# Altium project PowerPCB.PrjPcb
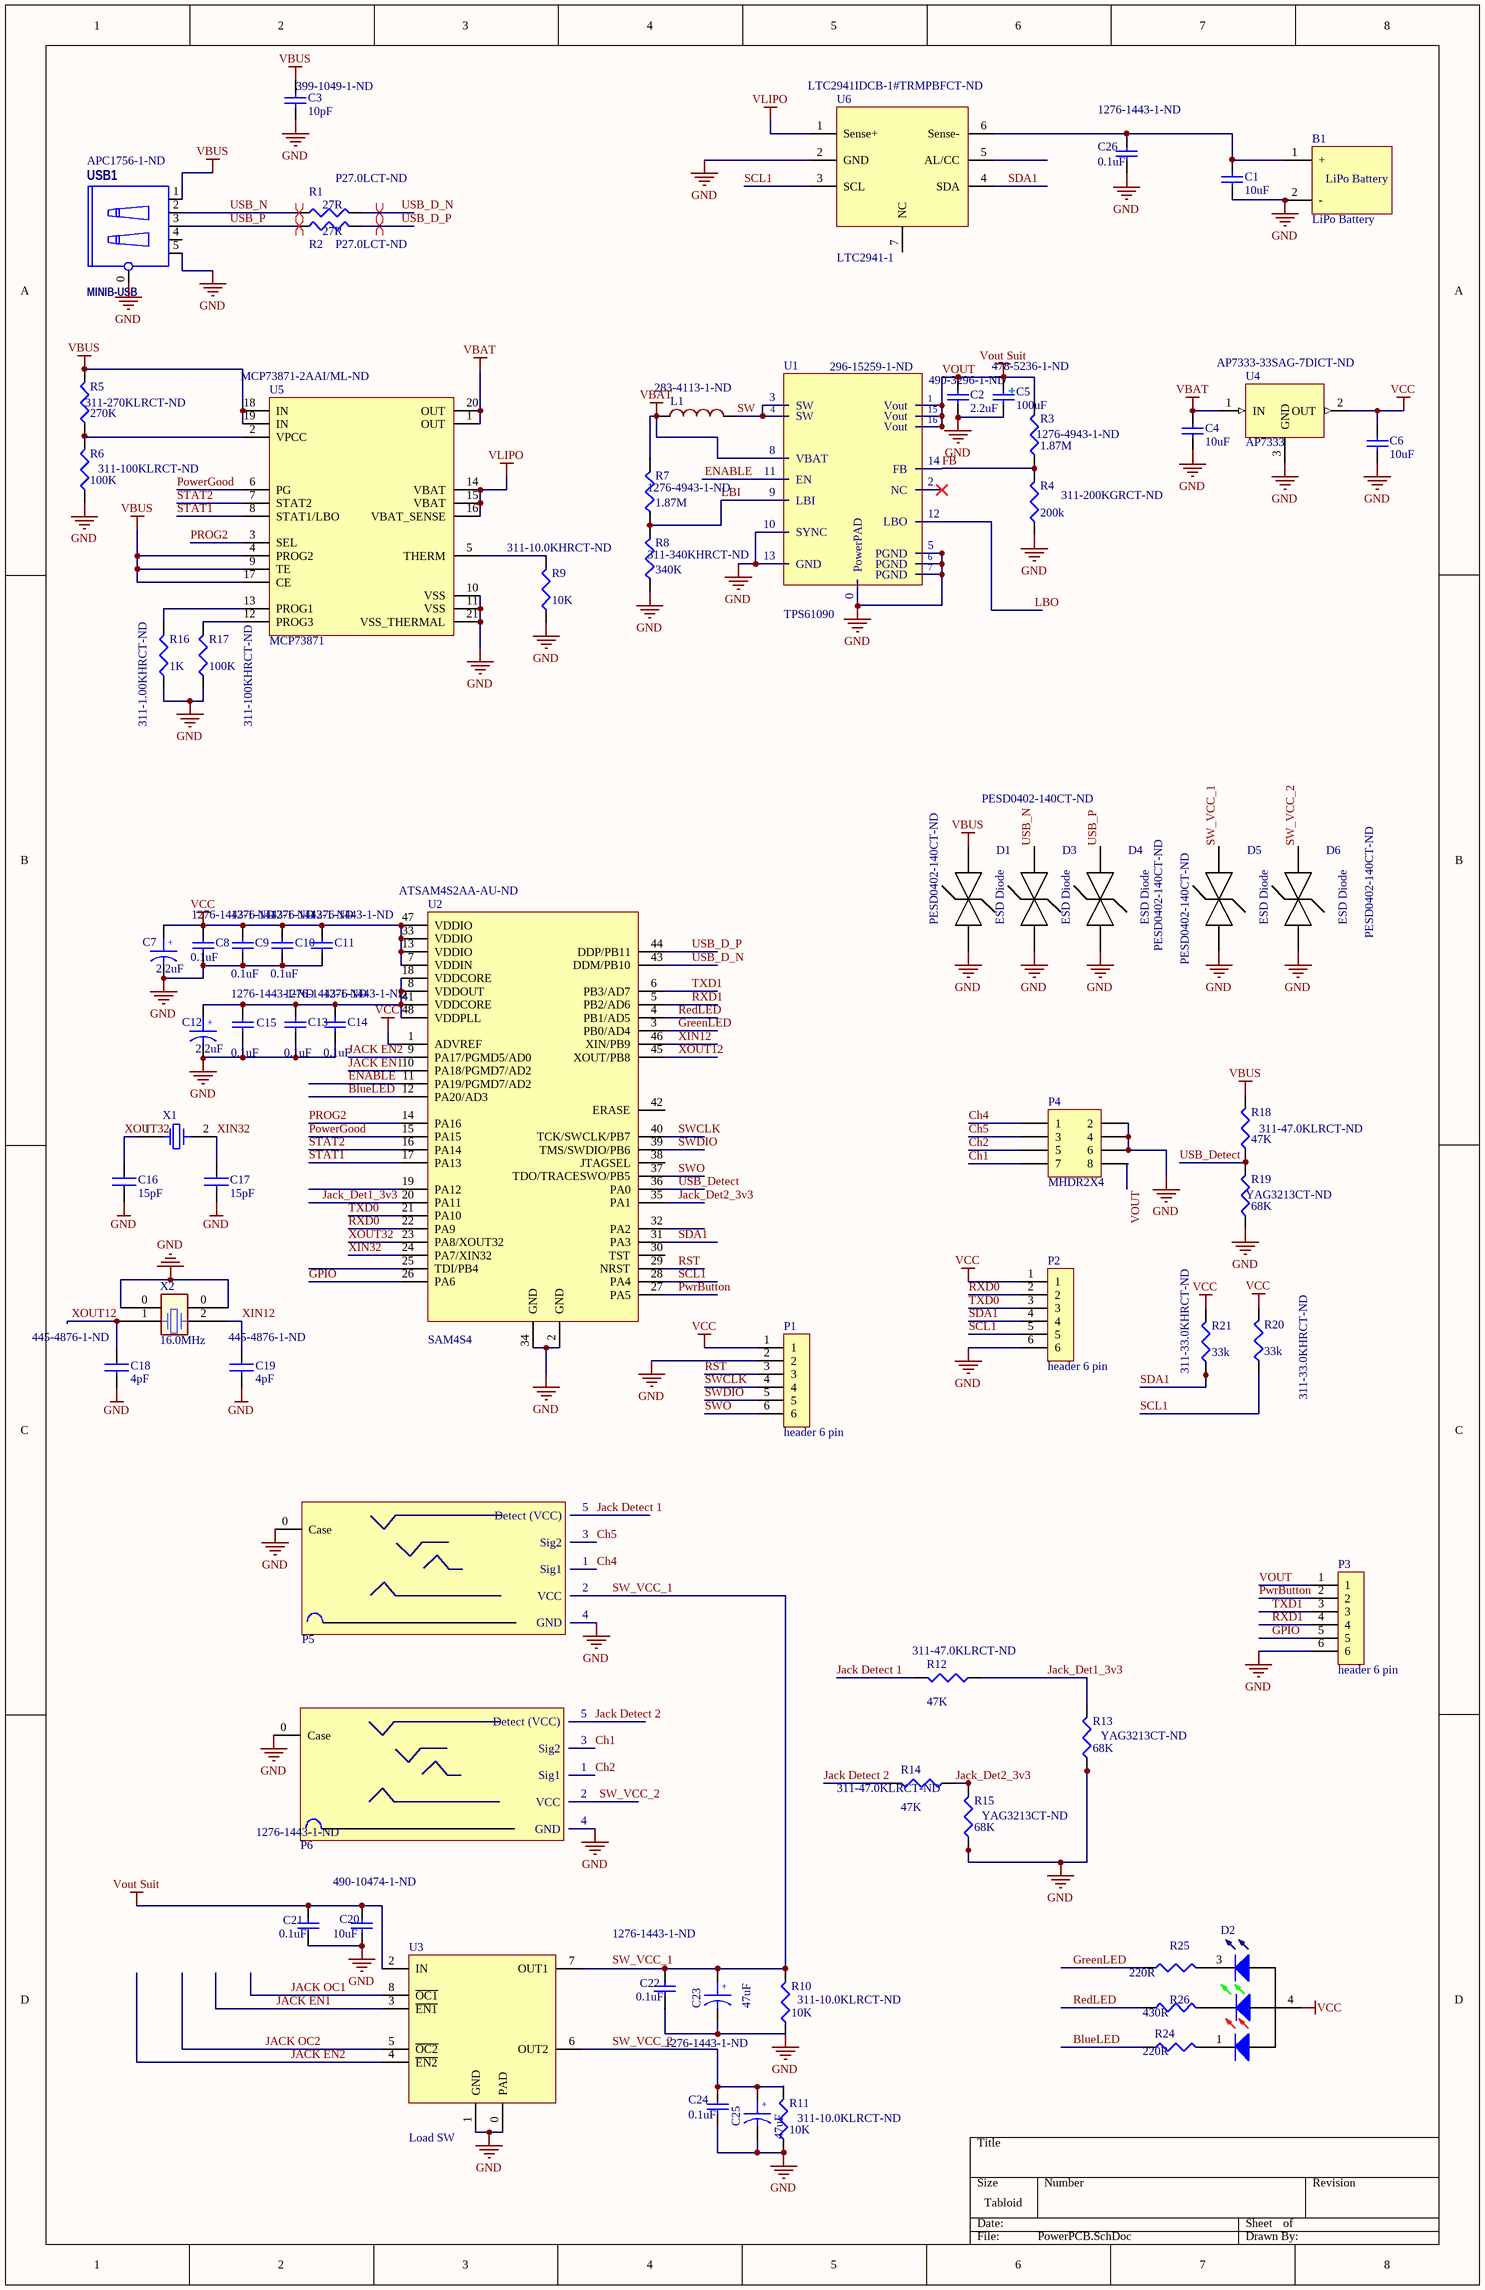
[diagram p0: PowerPCB.SchDoc]
1 sheet, 73 parts. Net scope: global (net labels, ports and power ports of the same name join across sheets).
Board file: PowerPCB.PcbDoc

## Sheet PowerPCB.SchDoc
size Tabloid portrait; PageSetup: Record=PageOptions|CenterHorizontal=True|CenterVertical=True|PrintScale=0.62|XCorrection=1.00|YCorrection=1.00|PrintKind=1|BorderSize=5000000|LeftOffset=0|BottomOffset=0|Orientation=1|PaperLength=1000|PaperWidth=1000|Scale=100|PaperSource=257|PrintQuality=600|MediaType=1|DitherType=10|PrintScaleMode=1|PaperKind=Letter|PaperIndex=1

### Parts
B1  LiPo Battery  [LiPo Battery]
C1  value 10uF  [0603_small]
C2  value 2.2uF  Supplier Part Number: 490-3296-1-ND  [0603_small]
C3  value 10pF  Supplier Part Number: 399-1049-1-ND  [0603_small]
C4  value 10uF  [0603_small]
C5  value 100uF  Supplier Part Number: 478-5236-1-ND  [C 6032-28R]  (hidden comment: Cap_Tant)
C6  value 10uF  [0603_small]
C7  value 2.2uF  [SMD0805]
C8  value 0.1uF  Supplier Part Number: 1276-1443-1-ND  [0402]
C9  value 0.1uF  Supplier Part Number: 1276-1443-1-ND  [0402]
C10  value 0.1uF  Supplier Part Number: 1276-1443-1-ND  [0402]
C11  Supplier Part Number: 1276-1443-1-ND  [0402]
C12  value 2.2uF  [SMD0805]
C13  value 0.1uF  Supplier Part Number: 1276-1443-1-ND  [0402]
C14  value 0.1uF  Supplier Part Number: 1276-1443-1-ND  [0402]
C15  value 0.1uF  Supplier Part Number: 1276-1443-1-ND  [0402]
C16  value 15pF  [CAP 0402]
C17  value 15pF  [CAP 0402]
C18  value 4pF  Supplier Part Number: 445-4876-1-ND  [0402]
C19  value 4pF  Supplier Part Number: 445-4876-1-ND  [0402]
C20  value 10uF  Supplier Part Number: 490-10474-1-ND  [0603_small]
C21  value 0.1uF  Supplier Part Number: 1276-1443-1-ND  [0402]
C22  value 0.1uF  Supplier Part Number: 1276-1443-1-ND  [0402]
C23  value 47uF  [1206]  (hidden comment: CAP-POL)
C24  value 0.1uF  Supplier Part Number: 1276-1443-1-ND  [0402]
C25  value 47uF  [1206]  (hidden comment: CAP-POL)
C26  value 0.1uF  Supplier Part Number: 1276-1443-1-ND  [0402]
D1  ESD Diode  Supplier Part Number: PESD0402-140CT-ND  [0402]
D2  LED2_RGB  [LED RGB]  (value not drawn)
D3  ESD Diode  Supplier Part Number: PESD0402-140CT-ND  [0402]
D4  ESD Diode  Supplier Part Number: PESD0402-140CT-ND  [0402]
D5  ESD Diode  Supplier Part Number 1: PESD0402-140CT-ND  [0402]
D6  ESD Diode  Supplier Part Number: PESD0402-140CT-ND  [0402]
L1  Supplier Part Number: 283-4113-1-ND  [Inductor - Small]  (hidden comment: 6.8uH)
P1  header 6 pin  [Header 6 1.27mm]
P2  header 6 pin  [Header 6 1.27mm]
P3  header 6 pin  [Header 6 1.27mm]
P4  MHDR2X4  [MHDR2X4]
P5  IP67_Jack  [AudioJack IPX7]  (value not drawn)
P6  IP67_Jack  [AudioJack IPX7]  (value not drawn)
R1  value 27R  Supplier Part Number: P27.0LCT-ND  [0402]
R2  value 27R  Supplier Part Number: P27.0LCT-ND  [0402]
R3  value 1.87M  Supplier Part Number: 1276-4943-1-ND  [0603_small]
R4  value 200k  Supplier Part Number: 311-200KGRCT-ND  [0603_small]
R5  value 270K  Supplier Part Number: 311-270KLRCT-ND  [0402]
R6  value 100K  Supplier Part Number: 311-100KLRCT-ND  [0402]
R7  value 1.87M  Supplier Part Number: 1276-4943-1-ND  [0603_small]
R8  value 340K  Supplier Part Number: 311-340KHRCT-ND  [0603_small]
R9  value 10K  Supplier Part Number: 311-10.0KHRCT-ND  [0603_small]
R10  value 10K  Supplier Part Number: 311-10.0KLRCT-ND  [0402]
R11  value 10K  Supplier Part Number: 311-10.0KLRCT-ND  [0402]
R12  value 47K  Supplier Part Number: 311-47.0KLRCT-ND  [0402]
R13  value 68K  Supplier Part Number: YAG3213CT-ND  [0402]
R14  value 47K  Supplier Part Number: 311-47.0KLRCT-ND  [0402]
R15  value 68K  Supplier Part Number: YAG3213CT-ND  [0402]
R16  value 1K  Supplier Part Number: 311-1.00KHRCT-ND  [0603_small]
R17  value 100K  Supplier Part Number: 311-100KHRCT-ND  [0603_small]
R18  value 47K  Supplier Part Number: 311-47.0KLRCT-ND  [0402]
R19  value 68K  Supplier Part Number: YAG3213CT-ND  [0402]
R20  value 33k  Supplier Part Number: 311-33.0KHRCT-ND  [0603_small]
R21  value 33k  Supplier Part Number: 311-33.0KHRCT-ND  [0603_small]
R24  value 220R  [0603_small]
R25  value 220R  [0603_small]
R26  value 430R  [0603_small]
U1  TPS61090  Supplier Part Number: 296-15259-1-ND  [QFN 16 PQFN VQFN PVQFN 16 RSA]
U2  SAM4S4  Supplier Part Number 1: ATSAM4S2AA-AU-ND  [QFP48]
U3  Load SW  [SON8_0.65MM]
U4  AP7333  Supplier Part Number 1: AP7333-33SAG-7DICT-ND  [SOT23-3]
U5  MCP73871  Supplier Part Number 1: MCP73871-2AAI/ML-ND  [QFN20]
U6  LTC2941-1  Supplier Part Number 1: LTC2941IDCB-1#TRMPBFCT-ND  [QFN6]
USB1  MINIB-USB  Supplier Part Number: APC1756-1-ND  [Micro USB IP67]
X1  Xtal 32  [Xtal smd 32khz - larger]  (value not drawn)
X2  value 16.0MHz  [Xtal smd 3.2X2.5]  (hidden comment: Xtal 16)

### Nets
GND: B1.2(-) C1.1 C2.1 C3.1 C4.1 C5.- C6.1 C7.2 C8.1 C9.1 C10.1 C11.1 C12.2 C13.1 C14.1 C15.1 C16.2 C17.2 C18.2 C19.2 C20.2 C21.2 C22.2 C23.2 C24.2 C25.2 C26.2 D1.2 D3.2 D4.2 D5.2 D6.2 P1.2 P2.6 P3.6 P4.2 P4.4 P4.6 P5.0(Case) P5.4(GND) P6.0(Case) P6.4(GND) R4.1 R6.1 R8.1 R9.1 R11.1 R13.1 R15.1 R16.1 R17.1 R19.1 U1.0(PowerPAD) U1.5(PGND) U1.6(PGND) U1.7(PGND) U1.10(SYNC) U1.13(GND) U2.2(GND) U2.34(GND) U3.0(PAD) U3.1(GND) U4.3(GND) U5.10(VSS) U5.11(VSS) U5.21(VSS_THERMAL) U6.2(GND) USB1.0(GND) USB1.5 X2.0
VBAT: C4.2 L1.1 R7.2 U1.8(VBAT) U4.1(IN) U5.1(OUT) U5.20(OUT)
VBUS: C3.2 D1.1 R5.2 R18.2 U5.4(PROG2) U5.9(TE) U5.17(CE) U5.18(IN) U5.19(IN) USB1.1
VCC: C6.2 C7.1 C8.2 C9.2 C10.2 C11.2 D2.4 P1.1 P2.1 R20.2 R21.2 U2.1(ADVREF) U2.7(VDDIN) U2.13(VDDIO) U2.33(VDDIO) U2.47(VDDIO) U4.2(OUT)
VLIPO: U5.14(VBAT) U5.15(VBAT) U5.16(VBAT_SENSE) U6.1(Sense+)
VOUT: C2.2 C5.+ C20.1 C21.1 P3.1 P4.8 R3.2 U1.1(Vout) U1.15(Vout) U1.16(Vout) U3.2(IN)  [also labelled Vout Suit]
BlueLED: R24.1 U2.12(PA20/AD3)
Ch1: P4.7 P6.3(Sig2)
Ch2: P4.5 P6.1(Sig1)
Ch4: P4.1 P5.1(Sig1)
Ch5: P4.3 P5.3(Sig2)
ENABLE: U1.11(EN) U2.11(PA19/PGMD7/AD2)
FB: R3.1 R4.2 U1.14(FB)
GPIO: P3.5 U2.26(PA6)
GreenLED: R25.1 U2.3(PB0/AD4)
Jack Detect 1: P5.5(Detect_(VCC)) R12.2
Jack Detect 2: P6.5(Detect_(VCC)) R14.2
JACK EN1: U2.10(PA18/PGMD7/AD2) U3.3(~{EN1})
JACK EN2: U2.9(PA17/PGMD5/AD0) U3.4(~{EN2})
JACK OC1: U3.8(~{OC1})
JACK OC2: U3.5(~{OC2})
Jack_Det1_3v3: R12.1 R13.2 U2.20(PA11)
Jack_Det2_3v3: R14.1 R15.2 U2.35(PA1)
LBI: R7.1 R8.2 U1.9(LBI)
LBO: U1.12(LBO)
PowerGood: U2.15(PA15) U5.6(PG)
PROG2: U2.14(PA16) U5.3(SEL)
PwrButton: P3.2 U2.27(PA5)
RedLED: R26.1 U2.4(PB1/AD5)
RST: P1.3 U2.29(NRST)
RXD0: P2.2 U2.22(PA9)
RXD1: P3.4 U2.5(PB2/AD6)
SCL1: P2.5 R20.1 U2.28(PA4) U6.3(SCL)
SDA1: P2.4 R21.1 U2.31(PA3) U6.4(SDA)
STAT1: U2.17(PA13) U5.8(STAT1/LBO)
STAT2: U2.16(PA14) U5.7(STAT2)
SW: L1.2 U1.3(SW) U1.4(SW)
SW_VCC_1: C22.1 C23.1 D5.1 P5.2(VCC) R10.2 U3.7(OUT1)
SW_VCC_2: C24.1 C25.1 D6.1 P6.2(VCC) R11.2 U3.6(OUT2)
SWCLK: P1.4 U2.40(TCK/SWCLK/PB7)
SWDIO: P1.5 U2.39(TMS/SWDIO/PB6)
SWO: P1.6 U2.37(TDO/TRACESWO/PB5)
TXD0: P2.3 U2.21(PA10)
TXD1: P3.3 U2.6(PB3/AD7)
USB_D_N: R1.2 U2.43(DDM/PB10)
USB_D_P: R2.2 U2.44(DDP/PB11)
USB_Detect: R18.1 R19.2 U2.36(PA0)
USB_N: D3.1 R1.1 USB1.2
USB_P: D4.1 R2.1 USB1.3
XIN12: C19.1 U2.46(XIN/PB9) X2.2
XIN32: C17.1 U2.24(PA7/XIN32) X1.2
XOUT12: C18.1 U2.45(XOUT/PB8) X2.1
XOUT32: C16.1 U2.23(PA8/XOUT32) X1.1
NetB1_1: B1.1(+) C1.2 C26.1 U6.6(Sense-)
NetC12_1: C12.1 C13.2 C14.2 C15.2 U2.8(VDDOUT) U2.18(VDDCORE) U2.41(VDDCORE) U2.48(VDDPLL)
NetD2_1: D2.1 R24.2
NetD2_2: D2.2 R26.2
NetD2_3: D2.3 R25.2
NetR5_1: R5.1 R6.2 U5.2(VPCC)
NetR9_2: R9.2 U5.5(THERM)
NetR16_2: R16.2 U5.13(PROG1)
NetR17_2: R17.2 U5.12(PROG3)

Not connected (* = marked no-connect by the designer): R10 1; U1 2(NC)*; U2 19(PA12) 25(TDI/PB4) 30(TST) 32(PA2) 38(JTAGSEL) 42(ERASE); U6 5(AL/CC) 7(NC); USB1 4

### Layout directives
differential pair: USB_D_N, USB_D_P, USB_N, USB_P

### Notes on the sheet
- Labels drawn without touching a wire or pin: SW_VCC_1
- (in symbol A01-0492) +

### Library data of the parts
C1 C4 C6 = Cap: Manufacturer Part Number: GRM188R61C106MA73D; Manufacturer: Murata Electronics North America; Capacitance: 10µF; Temperature Coefficient: X5R; Voltage - Rated: 16V; Tolerance: ±20%; Pricing: 1=0.25, 10=0.234, 25=0.1996, 50=0.1698, 100=0.1632, 250=0.14652, 500=0.13986, 1000=0.11655 (CAD); ComponentLink1URL: http://www.murata.com/~/media/webrenewal/support/library/catalog/products/capacitor/mlcc/c02e.ashx; ComponentLink1Description: http://www.murata.com/~/media/webrenewal/support/library/catalog/products/capacitor/mlcc/c02e.ashx; Lead Spacing: -; Applications: General Purpose; Height - Seated (Max): -; Package / Case: 0603 (1608 Metric); Mounting Type: Surface Mount, MLCC; Lead Style: -; Packaging: Cut Tape (CT); Operating Temperature: -55°C ~ 85°C; Category: Capacitors; Size / Dimension: 0.063" L x 0.031" W (1.60mm x 0.80mm); Ratings: -; Supplier: Digi-Key; Thickness (Max): 0.031" (0.80mm); RoHS: RoHS Compliant; Features: -
C2 = Cap: Manufacturer: Murata Electronics North America; Manufacturer Part Number: GRM188R61C225KE15D; Temperature Coefficient: X5R; Capacitance: 2.2µF; Tolerance: ±10%; Voltage - Rated: 16V; Size / Dimension: 0.063" L x 0.031" W (1.60mm x 0.80mm); Category: Capacitors; Applications: General Purpose; Packaging: Cut Tape (CT); Operating Temperature: -55°C ~ 85°C; Height - Seated (Max): -; Lead Style: -; Thickness (Max): 0.035" (0.90mm); RoHS: RoHS Compliant; Supplier: Digi-Key; Mounting Type: Surface Mount, MLCC; Lead Spacing: -; Features: -; Ratings: -; Package / Case: 0603 (1608 Metric); ComponentLink1URL: http://www.murata.com/~/media/webrenewal/support/library/catalog/products/capacitor/mlcc/c02e.ashx; ComponentLink1Description: http://www.murata.com/~/media/webrenewal/support/library/catalog/products/capacitor/mlcc/c02e.ashx; Pricing: 1=0.22, 10=0.154, 50=0.0884, 100=0.0731, 250=0.06152, 500=0.05154, 1000=0.0423 (CAD)
C3 = Cap: Manufacturer Part Number: C0603C100J5GACTU; Supplier 1: Digi-Key; Package / Case: 0603 (1608 Metric); Pricing: 1=0.15, 10=0.046, 50=0.0246, 100=0.021, 250=0.01708, 500=0.01462, 1000=0.0114 (CAD)
C5 = Cap_Tant: Capacitor; Manufacturer Size Code: C; Manufacturer Part Number: TPSC107M010R0075; Manufacturer: AVX Corporation; Type: Molded; Capacitance: 100µF; ESR (Equivalent Series Resistance): 75 mOhm; Voltage - Rated: 10V; Tolerance: ±20%; Lifetime @ Temp.: -; RoHS: RoHS Compliant; Mounting Type: Surface Mount; Size / Dimension: 0.236" L x 0.126" W (6.00mm x 3.20mm); Supplier: Digi-Key; Category: Capacitors; Package / Case: 2312 (6032 Metric); Height - Seated (Max): 0.110" (2.80mm); Lead Spacing: -; Features: General Purpose; Packaging: Cut Tape (CT); Operating Temperature: -55°C ~ 125°C; ComponentLink1URL: http://www.avx.com/docs/Catalogs/tps.pdf; ComponentLink1Description: http://www.avx.com/docs/Catalogs/tps.pdf; Pricing: 1=1.8, 10=1.475, 100=1.0438, 250=0.8638 (CAD)
C7 C12 = A01-0492: Manufacturer Size Code: P; Manufacturer: AVX Corporation; Manufacturer Part Number: F921A225MPA; Tolerance: ±20%; Type: Molded; ESR (Equivalent Series Resistance): 12 Ohm; Capacitance: 2.2µF; Voltage - Rated: 10V; Category: Capacitors; Size / Dimension: 0.079" L x 0.049" W (2.00mm x 1.25mm); RoHS: RoHS Compliant; Operating Temperature: -55°C ~ 125°C; Mounting Type: Surface Mount; Package / Case: 0805 (2012 Metric); Height - Seated (Max): 0.039" (1.00mm); Lifetime @ Temp.: -; Supplier: Digi-Key; Packaging: Cut Tape (CT); Features: General Purpose; Lead Spacing: -; Supplier Part Number: 478-8123-1-ND; ComponentLink1URL: http://www.avx.com/docs/Catalogs/f92.pdf; ComponentLink1Description: http://www.avx.com/docs/Catalogs/f92.pdf; Pricing: 1=0.45, 10=0.397, 100=0.1983, 250=0.15856, 500=0.14442, 1000=0.13025 (CAD)
C8-C10 C13-C15 = Cap: Capacitor; Manufacturer Part Number: CL05A104MP5NNNC; Manufacturer: Samsung Electro-Mechanics America, Inc.; Capacitance: 0.1µF; Voltage - Rated: 10V; Tolerance: ±20%; Temperature Coefficient: X5R; Ratings: -; Lead Spacing: -; Thickness (Max): 0.022" (0.55mm); Operating Temperature: -55°C ~ 85°C; Height - Seated (Max): -; Size / Dimension: 0.039" L x 0.020" W (1.00mm x 0.50mm); Package / Case: 0402 (1005 Metric); Lead Style: -; Mounting Type: Surface Mount, MLCC; Applications: General Purpose; Supplier: Digi-Key; Category: Capacitors; Features: -; RoHS: RoHS Compliant; Packaging: Cut Tape (CT); Pricing: 1=0.15, 10=0.017, 25=0.012, 50=0.0094, 100=0.0079, 500=0.00556, 1000=0.00433, 5000=0.00361 (CAD)
C11 = Cap: Capacitor; Manufacturer Part Number: CL05A104MP5NNNC; Manufacturer: Samsung Electro-Mechanics America, Inc.; Capacitance: 0.1µF; Voltage - Rated: 10V; Tolerance: ±20%; Temperature Coefficient: X5R; value: 0.1uF; Ratings: -; Lead Spacing: -; Thickness (Max): 0.022" (0.55mm); Operating Temperature: -55°C ~ 85°C; Height - Seated (Max): -; Size / Dimension: 0.039" L x 0.020" W (1.00mm x 0.50mm); Package / Case: 0402 (1005 Metric); Lead Style: -; Mounting Type: Surface Mount, MLCC; Applications: General Purpose; Supplier: Digi-Key; Category: Capacitors; Features: -; RoHS: RoHS Compliant; Packaging: Cut Tape (CT); Pricing: 1=0.15, 10=0.017, 25=0.012, 50=0.0094, 100=0.0079, 500=0.00556, 1000=0.00433, 5000=0.00361 (CAD)
C16 = A01-0013: Manufacturer Part Number: GJM1555C1H150JB01D; Manufacturer: Murata Electronics North America; Tolerance: ±5%; Voltage - Rated: 50V; Temperature Coefficient: C0G, NP0; Lead Style: -; Packaging: Cut Tape (CT); Height - Seated (Max): -; Capacitance: 15pF; Thickness (Max): 0.022" (0.55mm); Features: High Q, Low Loss; Ratings: -; Size / Dimension: 0.039" L x 0.020" W (1.00mm x 0.50mm); Operating Temperature: -55°C ~ 125°C; RoHS: RoHS Compliant; Mounting Type: Surface Mount, MLCC; Package / Case: 0402 (1005 Metric); Supplier Part Number: 490-3117-1-ND; Category: Capacitors; Applications: RF, Microwave, High Frequency; Lead Spacing: -; Supplier: Digi-Key
C17 = A01-0013: Manufacturer Part Number: GJM1555C1H150JB01D; Manufacturer: Murata Electronics North America; Voltage Rating DC: 50 V; Tolerance: ±5%; Voltage - Rated: 50V; Temperature Coefficient: C0G, NP0; Lead Style: -; Packaging: Cut Tape (CT); Height - Seated (Max): -; Capacitance: 15pF; Thickness (Max): 0.022" (0.55mm); Features: High Q, Low Loss; Ratings: -; Size / Dimension: 0.039" L x 0.020" W (1.00mm x 0.50mm); Operating Temperature: -55°C ~ 125°C; RoHS: RoHS Compliant; Mounting Type: Surface Mount, MLCC; Package / Case: 0402 (1005 Metric); Supplier Part Number: 490-3117-1-ND; Category: Capacitors; Applications: RF, Microwave, High Frequency; Lead Spacing: -; Supplier: Digi-Key
C18 C19 = A01-0018: Manufacturer Part Number: C1005C0G1H040B050BA; Manufacturer: TDK Corporation; Voltage - Rated: 50V; Temperature Coefficient: C0G, NP0; Tolerance: ±0.1pF; RoHS: RoHS Compliant; Supplier: Digi-Key; Lead Style: -; Package / Case: 0402 (1005 Metric); Capacitance: 4pF; Thickness (Max): 0.022" (0.55mm); Features: -; Height - Seated (Max): -; Mounting Type: Surface Mount, MLCC; Applications: General Purpose; Size / Dimension: 0.039" L x 0.020" W (1.00mm x 0.50mm); Operating Temperature: -55°C ~ 125°C; Category: Capacitors; Lead Spacing: -; Ratings: -; Packaging: Cut Tape (CT); Pricing: 1=0.15, 10=0.04, 100=0.0184, 250=0.01508, 500=0.0129, 1000=0.01004, 5000=0.00836 (CAD)
C20 = Cap: Manufacturer: Murata Electronics North America; Manufacturer Part Number: GRM188R61A106KE69D; Temperature Coefficient: X5R; Tolerance: ±10%; Voltage - Rated: 10V; Capacitance: 10µF; Lead Spacing: -; Thickness (Max): 0.037" (0.95mm); Ratings: -; Features: Derating Recommended; Operating Temperature: -55°C ~ 85°C; Mounting Type: Surface Mount, MLCC; Package / Case: 0603 (1608 Metric); Applications: General Purpose; Supplier: Digi-Key; Packaging: Cut Tape (CT); RoHS: RoHS Compliant; Height - Seated (Max): -; Size / Dimension: 0.063" L x 0.031" W (1.60mm x 0.80mm); Lead Style: -; Category: Capacitors; Pricing: 1=0.3, 10=0.21, 25=0.1576, 50=0.1208, 100=0.0998, 250=0.08392, 500=0.07032, 1000=0.05771 (CAD)
C21 C22 C24 C26 = Cap: Manufacturer Part Number: CL05A104MP5NNNC; Manufacturer: Samsung Electro-Mechanics America, Inc.; Capacitance: 0.1µF; Voltage - Rated: 10V; Tolerance: ±20%; Temperature Coefficient: X5R; Ratings: -; Lead Spacing: -; Thickness (Max): 0.022" (0.55mm); Operating Temperature: -55°C ~ 85°C; Height - Seated (Max): -; Size / Dimension: 0.039" L x 0.020" W (1.00mm x 0.50mm); Package / Case: 0402 (1005 Metric); Lead Style: -; Mounting Type: Surface Mount, MLCC; Applications: General Purpose; Supplier: Digi-Key; Category: Capacitors; Features: -; RoHS: RoHS Compliant; Packaging: Cut Tape (CT); Pricing: 1=0.15, 10=0.017, 25=0.012, 50=0.0094, 100=0.0079, 500=0.00556, 1000=0.00433, 5000=0.00361 (CAD)
C23 C25 = A01-0492: Manufacturer Part Number: TPSB476K010R0250; Manufacturer: AVX Corporation; Manufacturer Size Code: B; Type: Molded; Capacitance: 47µF; Tolerance: ±10%; Voltage - Rated: 10V; ESR (Equivalent Series Resistance): 250 mOhm; RoHS: RoHS Compliant; Supplier: Digi-Key; Packaging: Cut Tape (CT); Height - Seated (Max): 0.083" (2.10mm); Features: General Purpose; Category: Capacitors; Operating Temperature: -55°C ~ 125°C; Size / Dimension: 0.138" L x 0.110" W (3.50mm x 2.80mm); Lead Spacing: -; Package / Case: 1210 (3528 Metric); Supplier Part Number: 478-3085-1-ND; Lifetime @ Temp.: -; Mounting Type: Surface Mount; Pricing: 1=1.78, 10=1.479, 100=0.9438, 250=0.78656, 500=0.7079, 1000=0.64495 (CAD); ComponentLink1URL: http://www.avx.com/docs/Catalogs/tps.pdf; ComponentLink1Description: http://www.avx.com/docs/Catalogs/tps.pdf
D1 D3-D6 = ESD Diode: Manufacturer Part Number: PESD0402-140; Manufacturer: TE Connectivity Raychem Circuit Protection; Bidirectional Channels: 1; Voltage - Reverse Standoff (Typ): 14V (Max); Voltage - Clamping (Max) @ Ipp: 40V; Power Line Protection: No; Type: Zener; Supplier: Digi-Key; Category: Circuit Protection; Unidirectional Channels: -; Voltage - Breakdown (Min): -; Applications: Ethernet, HDMI; Packaging: Cut Tape (CT); Capacitance @ Frequency: -; Package / Case: 0402 (1005 Metric); Power - Peak Pulse: -; Operating Temperature: -55°C ~ 125°C (TJ); Supplier Device Package: 0402; Mounting Type: Surface Mount; Current - Peak Pulse (10/1000µs): -; RoHS: RoHS Compliant
  D5 D6: Supplier 1: Digi-Key
D2 = LED2_RGB: RGB Led; Manufacturer Part Number: LTST-C19HE1WT; Manufacturer: Lite-On Inc; Lens Transparency: Diffused; Millicandela Rating: 112.5mcd Red, 281mcd Green, 104mcd Blue; Wavelength - Dominant: 624nm Red, 525nm Green, 470nm Blue; Wavelength - Peak: 632nm Red, 520nm Green, 468nm Blue; Lens Color: White; Current - Test: 20mA Red, 20mA Green, 20mA Blue; Voltage - Forward (Vf) (Typ): 2.1V Red, 3.35V Green, 3.35V Blue; Color: Red, Green, Blue (RGB); Lens Style/Size: Rectangle with Flat Top, 1.15mm x 1.60mm; Viewing Angle: 130°; Package / Case: 0606 (1616 Metric); Supplier: Digi-Key; Height (Max): 0.35mm; Size / Dimension: 1.60mm L x 1.60mm W; RoHS: RoHS Compliant; Mounting Type: Surface Mount; Category: Optoelectronics; Packaging: Cut Tape (CT); Supplier Device Package: *; Pricing: 1=0.82, 10=0.632, 100=0.4097, 250=0.35112, 500=0.3043, 1000=0.23407 (CAD); ComponentLink1URL: http://optoelectronics.liteon.com/upload/download/DS22-2008-0044/S_110_LTST-C19HE1WT.pdf; ComponentLink1Description: http://optoelectronics.liteon.com/upload/download/DS22-2008-0044/S_110_LTST-C19HE1WT.pdf; Supplier Part Number: 160-2162-1-ND
L1 = L6.2uH: Inductor; Manufacturer Part Number: MPI4040R4-6R8-R; Manufacturer: Eaton Bussmann; Frequency - Test: 100kHz; Shielding: Shielded; Type: Wirewound; Material - Core: Metal Composite; Current - Saturation: 3.2A; Tolerance: ±20%; Inductance: 6.8µH; Current Rating: 2.4A; DC Resistance (DCR): 91 mOhm; Supplier 1: Digi-Key; RoHS: RoHS Compliant; Size / Dimension: 0.175" L x 0.160" W (4.45mm x 4.06mm); Category: Inductors, Coils, Chokes; Q @ Freq: -; Mounting Type: Surface Mount; Height - Seated (Max): 0.079" (2.00mm); Frequency - Self Resonant: -; Operating Temperature: -40°C ~ 125°C; Supplier Device Package: -; Packaging: Digi-Reel®; Package / Case: 1816 (4540 Metric); Supplier: Digi-Key; Pricing: 1=2.52, 10=2.36, 50=1.8876, 100=1.7933, 500=1.44722, 1000=1.32137 (CAD)
P4 = MHDR2X4: Header, 4-Pin, Dual row; LatestRevisionDate: 17-Jul-2002; LatestRevisionNote: Re-released for DXP Platform.; Publisher: Altium Limited
P5 P6 = IP67_Jack: IP67 4 pole jack; Manufacturer Part Number: LGY2109-4900F; Manufacturer: SMK
R1 R2 = Res3: Resistor; Manufacturer Part Number: ERJ-2RKF27R0X; Manufacturer: Panasonic Electronic Components; Resistance (Ohms): 27; Power (Watts): 0.1W, 1/10W; Temperature Coefficient: ±100ppm/°C; Tolerance: ±1%; RoHS: RoHS Compliant; Supplier Device Package: 0402; Composition: Thick Film; Package / Case: 0402 (1005 Metric); Operating Temperature: -55°C ~ 155°C; Supplier: Digi-Key; Category: Resistors; Packaging: Cut Tape (CT); Number of Terminations: 2; Size / Dimension: 0.039" L x 0.020" W (1.00mm x 0.50mm); Features: Automotive AEC-Q200; Height: 0.016" (0.40mm); Pricing: 1=0.16, 50=0.0242, 100=0.0178, 250=0.0136, 500=0.01092, 1000=0.00803, 5000=0.00575 (CAD)
R3 R7 = Res3: Manufacturer Part Number: RC1608F1874CS; Manufacturer: Samsung Electro-Mechanics America, Inc.; Tolerance: ±1%; Temperature Coefficient: ±100ppm/°C; Power (Watts): 0.1W, 1/10W; Pricing: 1=0.15, 10=0.021, 25=0.0148, 50=0.0116, 100=0.0085, 250=0.00648, 500=0.00518, 1000=0.00383, 2500=0.00332 (CAD); ComponentLink1URL: http://www.samsungsem.com/global/support/library/product-catalog/__icsFiles/afieldfile/2015/01/12/CHIP_RESISTOR_150112_1.pdf; ComponentLink1Description: http://www.samsungsem.com/global/support/library/product-catalog/__icsFiles/afieldfile/2015/01/12/CHIP_RESISTOR_150112_1.pdf; Operating Temperature: -55°C ~ 155°C; Features: -; Resistance (Ohms): 1.87M; Supplier: Digi-Key; Package / Case: 0603 (1608 Metric); Packaging: Cut Tape (CT); Supplier Device Package: 0603 (1608 Metric); Height: 0.022" (0.55mm); RoHS: RoHS Compliant; Size / Dimension: 0.063" L x 0.031" W (1.60mm x 0.80mm); Composition: Thick Film; Number of Terminations: 2; Category: Resistors
R4 = Res3: Manufacturer: Yageo; Manufacturer Part Number: RC0603JR-07200KL; Power (Watts): 0.1W, 1/10W; Tolerance: ±5%; Temperature Coefficient: ±100ppm/°C; Pricing: 1=0.15, 10=0.017, 25=0.0124, 100=0.0067, 250=0.00516, 500=0.00414, 1000=0.00304, 2500=0.00264 (CAD); ComponentLink1URL: http://www.yageo.com/NewPortal/yageodocoutput?fileName=/pdf/R-Chip/PYu-RC_Group_51_RoHS_L_3.pdf; ComponentLink1Description: http://www.yageo.com/NewPortal/yageodocoutput?fileName=/pdf/R-Chip/PYu-RC_Group_51_RoHS_L_3.pdf; RoHS: RoHS Compliant; Size / Dimension: 0.063" L x 0.031" W (1.60mm x 0.80mm); Packaging: Cut Tape (CT); Supplier Device Package: 0603; Features: Moisture Resistant; Height: 0.022" (0.55mm); Composition: Thick Film; Resistance (Ohms): 200k; Operating Temperature: -55°C ~ 155°C; Package / Case: 0603 (1608 Metric); Category: Resistors; Supplier: Digi-Key; Number of Terminations: 2
R5 = Res3: Manufacturer Part Number: RC0402FR-07270KL; Manufacturer: Yageo; Power (Watts): 0.063W, 1/16W; Tolerance: ±1%; Temperature Coefficient: ±100ppm/°C; Height: 0.016" (0.40mm); Package / Case: 0402 (1005 Metric); Supplier: Digi-Key; Composition: Thick Film; Size / Dimension: 0.039" L x 0.020" W (1.00mm x 0.50mm); Packaging: Cut Tape (CT); Supplier Device Package: 0402; Category: Resistors; Features: Moisture Resistant; RoHS: RoHS Compliant; Number of Terminations: 2; Resistance (Ohms): 270k; Operating Temperature: -55°C ~ 155°C; Pricing: 1=0.16, 10=0.021, 25=0.0156, 100=0.0087, 250=0.00668, 500=0.00532, 1000=0.00392, 2500=0.0034, 5000=0.00281 (CAD)
R6 = Res3: Resistor; Manufacturer Part Number: RC0402FR-07100KL; Manufacturer: Yageo; Temperature Coefficient: ±100ppm/°C; Power (Watts): 0.063W, 1/16W; Tolerance: ±1%; Size / Dimension: 0.039" L x 0.020" W (1.00mm x 0.50mm); Operating Temperature: -55°C ~ 155°C; Features: Moisture Resistant; Resistance (Ohms): 100k; Height: 0.016" (0.40mm); Package / Case: 0402 (1005 Metric); Composition: Thick Film; Number of Terminations: 2; Supplier Device Package: 0402; Supplier: Digi-Key; Category: Resistors; RoHS: RoHS Compliant; Packaging: Cut Tape (CT); Pricing: 1=0.16, 10=0.021, 25=0.0156, 100=0.0087, 250=0.00668, 500=0.00532, 1000=0.00392, 2500=0.0034, 5000=0.00281 (CAD)
R8 = Res3: Resistor; Manufacturer Part Number: RC0603FR-07340KL; Manufacturer: Yageo; Power (Watts): 0.1W, 1/10W; Tolerance: ±1%; Temperature Coefficient: ±100ppm/°C; Supplier Device Package: 0603; Package / Case: 0603 (1608 Metric); Features: Moisture Resistant; Operating Temperature: -55°C ~ 155°C; RoHS: RoHS Compliant; Number of Terminations: 2; Resistance (Ohms): 340k; Packaging: Cut Tape (CT); Composition: Thick Film; Supplier: Digi-Key; Size / Dimension: 0.063" L x 0.031" W (1.60mm x 0.80mm); Category: Resistors; Height: 0.022" (0.55mm); ComponentLink1URL: http://www.yageo.com/NewPortal/yageodocoutput?fileName=/pdf/R-Chip/PYu-RC_Group_51_RoHS_L_3.pdf; ComponentLink1Description: http://www.yageo.com/NewPortal/yageodocoutput?fileName=/pdf/R-Chip/PYu-RC_Group_51_RoHS_L_3.pdf; Pricing: 1=0.15, 10=0.021, 25=0.0148, 100=0.0085, 250=0.00648, 500=0.00518, 1000=0.00383, 2500=0.00332 (CAD)
R9 = Res3: Manufacturer Part Number: RC0603FR-0710KL; Manufacturer: Yageo; Temperature Coefficient: ±100ppm/°C; Tolerance: ±1%; Power (Watts): 0.1W, 1/10W; Supplier Device Package: 0603; RoHS: RoHS Compliant; Features: Moisture Resistant; Number of Terminations: 2; Composition: Thick Film; Operating Temperature: -55°C ~ 155°C; Packaging: Cut Tape (CT); Height: 0.022" (0.55mm); Size / Dimension: 0.063" L x 0.031" W (1.60mm x 0.80mm); Package / Case: 0603 (1608 Metric); Category: Resistors; Resistance (Ohms): 10k; Supplier: Digi-Key; Pricing: 1=0.16, 10=0.023, 25=0.016, 100=0.0092, 250=0.00708, 500=0.00564, 1000=0.00416, 2500=0.00361 (CAD)
R10 R11 = Res3: Resistor; Manufacturer Part Number: RC0402FR-0710KL; Manufacturer: Yageo; Power (Watts): 0.063W, 1/16W; Tolerance: ±1%; Temperature Coefficient: ±100ppm/°C; Category: Resistors; Size / Dimension: 0.039" L x 0.020" W (1.00mm x 0.50mm); Features: Moisture Resistant; Resistance (Ohms): 10k; Number of Terminations: 2; Composition: Thick Film; Supplier: Digi-Key; Package / Case: 0402 (1005 Metric); RoHS: RoHS Compliant; Height: 0.016" (0.40mm); Packaging: Cut Tape (CT); Supplier Device Package: 0402; Operating Temperature: -55°C ~ 155°C
R12 R14 R18 = Res3: Manufacturer Part Number: RC0402FR-0747KL; Manufacturer: Yageo; Tolerance: ±1%; Temperature Coefficient: ±100ppm/°C; Power (Watts): 0.063W, 1/16W; Number of Terminations: 2; Category: Resistors; Composition: Thick Film; Supplier: Digi-Key; Features: Moisture Resistant; Resistance (Ohms): 47k; Operating Temperature: -55°C ~ 155°C; Package / Case: 0402 (1005 Metric); Packaging: Cut Tape (CT); Height: 0.016" (0.40mm); RoHS: RoHS Compliant; Supplier Device Package: 0402; Size / Dimension: 0.039" L x 0.020" W (1.00mm x 0.50mm); Pricing: 1=0.16, 10=0.021, 25=0.0156, 100=0.0087, 250=0.00668, 500=0.00532, 1000=0.00392, 2500=0.0034, 5000=0.00281 (CAD)
R13 R15 R19 = Res3: Resistor; Manufacturer Part Number: RC0402FR-0768K1L; Manufacturer: Yageo; Temperature Coefficient: ±100ppm/°C; Tolerance: ±1%; Power (Watts): 0.063W, 1/16W; Resistance (Ohms): 68.1k; Operating Temperature: -55°C ~ 155°C; Packaging: Cut Tape (CT); Height: 0.016" (0.40mm); Category: Resistors; Size / Dimension: 0.039" L x 0.020" W (1.00mm x 0.50mm); Supplier: Digi-Key; Composition: Thick Film; Features: Moisture Resistant; Supplier Device Package: 0402; Number of Terminations: 2; RoHS: RoHS Compliant; Package / Case: 0402 (1005 Metric); Pricing: 1=0.16, 10=0.019, 25=0.0136, 100=0.0078, 250=0.00596, 500=0.00476, 1000=0.0035, 2500=0.00303, 5000=0.0025 (CAD)
R16 = Res3: Manufacturer: Yageo; Manufacturer Part Number: RC0603FR-071KL; Tolerance: ±1%; Temperature Coefficient: ±100ppm/°C; Power (Watts): 0.1W, 1/10W; Packaging: Cut Tape (CT); Category: Resistors; Supplier: Digi-Key; Composition: Thick Film; Number of Terminations: 2; Supplier Device Package: 0603; Size / Dimension: 0.063" L x 0.031" W (1.60mm x 0.80mm); RoHS: RoHS Compliant; Resistance (Ohms): 1k; Package / Case: 0603 (1608 Metric); Operating Temperature: -55°C ~ 155°C; Features: Moisture Resistant; Height: 0.022" (0.55mm); Pricing: 1=0.16, 10=0.023, 25=0.016, 100=0.0092, 250=0.00708, 500=0.00564, 1000=0.00416, 2500=0.00361 (CAD)
R17 = Res3: Manufacturer Part Number: RC0603FR-07100KL; Manufacturer: Yageo; Temperature Coefficient: ±100ppm/°C; Power (Watts): 0.1W, 1/10W; Tolerance: ±1%; Operating Temperature: -55°C ~ 155°C; Resistance (Ohms): 100k; Number of Terminations: 2; Composition: Thick Film; Packaging: Cut Tape (CT); Supplier Device Package: 0603; RoHS: RoHS Compliant; Size / Dimension: 0.063" L x 0.031" W (1.60mm x 0.80mm); Supplier: Digi-Key; Features: Moisture Resistant; Category: Resistors; Package / Case: 0603 (1608 Metric); Height: 0.022" (0.55mm); Pricing: 1=0.16, 10=0.023, 25=0.016, 100=0.0092, 250=0.00708, 500=0.00564, 1000=0.00416, 2500=0.00361 (CAD)
R20 = Res3: Resistor; Manufacturer Part Number: RC0603FR-0733KL; Manufacturer: Yageo; Temperature Coefficient: ±100ppm/°C; Power (Watts): 0.1W, 1/10W; Tolerance: ±1%; Supplier: Digi-Key; Number of Terminations: 2; Supplier Device Package: 0603; Composition: Thick Film; Operating Temperature: -55°C ~ 155°C; Package / Case: 0603 (1608 Metric); Height: 0.022" (0.55mm); Category: Resistors; Resistance (Ohms): 33k; Size / Dimension: 0.063" L x 0.031" W (1.60mm x 0.80mm); Features: Moisture Resistant; Packaging: Cut Tape (CT); RoHS: RoHS Compliant; Pricing: 1=0.16, 10=0.023, 25=0.016, 100=0.0092, 250=0.00708, 500=0.00564, 1000=0.00416, 2500=0.00361 (CAD)
R21 = Res3: Manufacturer Part Number: RC0603FR-0733KL; Manufacturer: Yageo; Temperature Coefficient: ±100ppm/°C; Power (Watts): 0.1W, 1/10W; Tolerance: ±1%; Supplier: Digi-Key; Number of Terminations: 2; Supplier Device Package: 0603; Composition: Thick Film; Operating Temperature: -55°C ~ 155°C; Package / Case: 0603 (1608 Metric); Height: 0.022" (0.55mm); Category: Resistors; Resistance (Ohms): 33k; Size / Dimension: 0.063" L x 0.031" W (1.60mm x 0.80mm); Features: Moisture Resistant; Packaging: Cut Tape (CT); RoHS: RoHS Compliant; Pricing: 1=0.16, 10=0.023, 25=0.016, 100=0.0092, 250=0.00708, 500=0.00564, 1000=0.00416, 2500=0.00361 (CAD)
R24 R25 = Res3: Resistor; Manufacturer Part Number: ESR03EZPJ221; Manufacturer: Rohm Semiconductor; Power (Watts): 0.25W, 1/4W; Resistance (Ohms): 220; Temperature Coefficient: ±200ppm/°C; Tolerance: ±5%; Package / Case: 0603 (1608 Metric); Number of Terminations: 2; Features: Automotive AEC-Q200, Pulse Withstanding; Packaging: Cut Tape (CT); Supplier: Digi-Key; Size / Dimension: 0.063" L x 0.031" W (1.60mm x 0.80mm); Supplier Part Number: RHM220DCT-ND; Height: 0.022" (0.55mm); Composition: Thick Film; RoHS: RoHS Compliant; Supplier Device Package: 0603 (1608 Metric); Operating Temperature: -55°C ~ 155°C; Category: Resistors; ComponentLink1URL: http://rohmfs.rohm.com/en/products/databook/datasheet/passive/resistor/chip_resistor/esr.pdf; ComponentLink1Description: http://rohmfs.rohm.com/en/products/databook/datasheet/passive/resistor/chip_resistor/esr.pdf; Pricing: 1=0.15, 10=0.118, 25=0.0812, 100=0.0451, 250=0.03516, 500=0.02794, 1000=0.01982 (CAD)
R26 = Res3: Resistor; Manufacturer Part Number: ESR03EZPJ431; Manufacturer: Rohm Semiconductor; Temperature Coefficient: ±200ppm/°C; Power (Watts): 0.25W, 1/4W; Tolerance: ±5%; Resistance (Ohms): 430; Supplier Part Number: RHM430DCT-ND; Composition: Thick Film; Features: Automotive AEC-Q200, Pulse Withstanding; Supplier Device Package: 0603 (1608 Metric); Number of Terminations: 2; Supplier: Digi-Key; Size / Dimension: 0.063" L x 0.031" W (1.60mm x 0.80mm); Operating Temperature: -55°C ~ 155°C; Height: 0.022" (0.55mm); Packaging: Cut Tape (CT); Package / Case: 0603 (1608 Metric); RoHS: RoHS Compliant; Category: Resistors; ComponentLink1URL: http://rohmfs.rohm.com/en/products/databook/datasheet/passive/resistor/chip_resistor/esr.pdf; ComponentLink1Description: http://rohmfs.rohm.com/en/products/databook/datasheet/passive/resistor/chip_resistor/esr.pdf; Pricing: 1=0.15, 10=0.118, 25=0.0812, 100=0.0451, 250=0.03516, 500=0.02794, 1000=0.01982 (CAD)
U1 = TPS61090: Synchronous Boost Converter With 2-A Switch; Manufacturer Part Number: TPS61090RSAR; Manufacturer: Texas Instruments; Output Type: Adjustable; Output Configuration: Positive; Number of Outputs: 1; Voltage - Input (Min): 1.8V; Function: Step-Up; Voltage - Input (Max): 5.5V; Current - Output: 2A (Switch); Frequency - Switching: 600kHz; Synchronous Rectifier: Yes; Pricing: 1=3.82, 10=3.44, 25=2.9784, 50=2.7966, 100=2.7686, 250=2.46096, 500=2.08344, 750=1.88767, 1000=1.49441 (CAD); ComponentLink1URL: http://www.ti.com/lit/ds/symlink/tps61090.pdf; ComponentLink1Description: http://www.ti.com/lit/ds/symlink/tps61090.pdf; Topology: Boost; Category: Integrated Circuits (ICs); Supplier: Digi-Key; RoHS: RoHS Compliant; Packaging: Cut Tape (CT); Voltage - Output (Min/Fixed): 1.8V; Voltage - Output (Max): 5.5V; Operating Temperature: -40°C ~ 85°C (TA); Mounting Type: Surface Mount; Package / Case: 16-VQFN Exposed Pad; Supplier Device Package: 16-QFN (4x4)
U2 = SAM4S4: Manufacturer Part Number: ATSAM4S2AA-AU; Manufacturer: Atmel; Speed: 120MHz; Core Processor: ARM® Cortex®-M4; Connectivity: I²C, IrDA, Memory Card, SPI, SSC, UART/USART, USB; Core Size: 32-Bit; Data Converters: A/D 8x12b; Voltage - Supply (Vcc/Vdd): 1.62 V ~ 3.6 V; Program Memory Type: FLASH; RAM Size: 64K x 8; Number of I/O: 34; Peripherals: Brown-out Detect/Reset, DMA, POR, PWM, WDT; Program Memory Size: 128KB (128K x 8); Oscillator Type: Internal; Supplier 1: Digi-Key; Category: Integrated Circuits (ICs); RoHS: RoHS Compliant; Supplier: Digi-Key; Packaging: Tray; EEPROM Size: -; Supplier Device Package: 48-LQFP (7x7); Package / Case: 48-LQFP; Operating Temperature: -40°C ~ 85°C (TA)
U3 = TPS2042: CURRENT-LIMITED, POWER-DISTRIBUTION SWITCHES; Manufacturer Part Number: TPS2042BDR; Manufacturer: Texas Instruments; Voltage - Load: 2.7 V ~ 5.5 V; Current - Output (Max): 500mA; Voltage - Supply (Vcc/Vdd): Not Required; Interface: On/Off; Switch Type: General Purpose; Output Type: N-Channel; Input Type: Non-Inverting; Fault Protection: Current Limiting (Fixed), Over Temperature, UVLO; Ratio - Input:Output: 1:2; Rds On (Typ): 70 mOhm; Output Configuration: High Side; Number of Outputs: 2; Pricing: 1=2.59, 10=2.069, 100=1.6639, 500=1.31438, 1000=1.20531 (CAD); ComponentLink1URL: http://www.ti.com/lit/ds/symlink/tps2051b.pdf; ComponentLink1Description: http://www.ti.com/lit/ds/symlink/tps2051b.pdf; Supplier Part Number: 296-17002-1-ND; Supplier: Digi-Key; Supplier Device Package: 8-SOIC; RoHS: RoHS Compliant; Category: Integrated Circuits (ICs); Operating Temperature: -40°C ~ 125°C (TJ); Packaging: Cut Tape (CT); Features: Status Flag; Package / Case: 8-SOIC (0.154", 3.90mm Width)
U4 = AP7333: 3.3 V regulator; Manufacturer: Diodes Incorporated; Manufacturer Part Number: AP7333-33SAG-7; Current - Limit (Min): 400mA; Current - Output: 300mA; Number of Regulators: 1; Supplier 1: Digi-Key; Category: Integrated Circuits (ICs); Operating Temperature: -40°C ~ 85°C; Mounting Type: Surface Mount; Package / Case: TO-236-3, SC-59, SOT-23-3
U5 = MCP73871: Manufacturer: Microchip Technology; Manufacturer Part Number: MCP73871-2AAI/ML; Battery Chemistry: Li-Ion, Li-Pol; Function: Charge Management; Supplier 1: Digi-Key; Category: Integrated Circuits (ICs); Operating Temperature: -40°C ~ 85°C; Package / Case: 20-VFQFN Exposed Pad; Mounting Type: Surface Mount; Packaging: Tube
U6 = LTC2941-1: Manufacturer: Linear Technology; Manufacturer Part Number: LTC2941IDCB-1#TRMPBF; Function: Fuel, Gas Gauge/Monitor; Battery Chemistry: All Battery Types; Supplier 1: Digi-Key; Packaging: Cut Tape (CT); Category: Integrated Circuits (ICs); RoHS: RoHS Compliant; Operating Temperature: -40°C ~ 85°C; Mounting Type: Surface Mount; Package / Case: 6-WFDFN Exposed Pad
USB1 = CON-USB_1: Manufacturer: Amphenol PCD; MPNPV: UX60-MB-5ST; Manufacturer Part Number: MUC-20PFFR-JS8C01; PN-SST: 325-022; ID-PV: 557; SMT: TH; CostPV: 0.3; descPV: MINI "B" USB 5P SMT; statPV: U; typePV: CONNECTOR; Specifications: USB 2.0; Connector Type: USB - micro AB; Gender: Receptacle; Number of Contacts: 5; Ingress Protection: IP68 - Dust Tight, Waterproof; VAL: MINIB-USB; DigiKeyPartNumber: H2959TR-ND; IDPV: 557; Features: Board Lock; Mounting Type: Surface Mount, Right Angle, Horizontal; Supplier: Digi-Key; Packaging: Cut Tape (CT); RoHS: RoHS Compliant; Category: Connectors, Interconnects; ComponentLink1URL: http://www.amphenolltw.com/2012download/2D%20PDF/04_USB%20Connectors/MUC-20PFFR-JSXX01(B).pdf; ComponentLink1Description: http://www.amphenolltw.com/2012download/2D%20PDF/04_USB%20Connectors/MUC-20PFFR-JSXX01(B).pdf; Pricing: 1=6.31, 10=6.048, 25=5.544, 50=5.2916, 100=5.0398, 250=4.40976, 500=4.28378 (CAD)
X1 = Xtal 32: Manufacturer Part Number: ST3215SB32768E0HPWBB; Manufacturer: AVX Corp/Kyocera Corp; Load Capacitance: 9pF; Frequency Tolerance: ±20ppm; Operating Mode: Fundamental; ESR (Equivalent Series Resistance): 70 kOhm; Frequency Stability: ±200ppm; Frequency: 32.768kHz; Pricing: 1=1.13, 10=1.01, 50=0.9422, 100=0.8338, 500=0.78798, 750=0.74628, 1000=0.65873 (CAD); ComponentLink1URL: http://www.kyocera-crystal.jp/eng/wp-content/uploads/2014/09/st3215sb_e.pdf; ComponentLink1Description: http://www.kyocera-crystal.jp/eng/wp-content/uploads/2014/09/st3215sb_e.pdf; Mounting Type: Surface Mount; RoHS: RoHS Compliant; Ratings: -; Operating Temperature: -40°C ~ 85°C; Type: kHz Crystal (Tuning Fork); Size / Dimension: 0.126" L x 0.059" W (3.20mm x 1.50mm); Height: 0.035" (0.90mm); Category: Crystals and Oscillators; Package / Case: 2-SMD, No Lead (DFN, LCC); Packaging: Cut Tape (CT); Supplier Part Number: 1253-1335-1-ND; Supplier: Digi-Key
X2 = Xtal 12: Manufacturer Part Number: CX3225CA16000H0HSSCC; Manufacturer: AVX Corp/Kyocera Corp; Frequency Tolerance: ±20ppm; Operating Mode: Fundamental; Load Capacitance: 12pF; Frequency Stability: ±50ppm; ESR (Equivalent Series Resistance): 100 Ohm; Frequency: 16MHz; ComponentLink1URL: http://media.digikey.com/pdf/Data%20Sheets/AVX%20PDFs/CX3225CA16000H0HSSCC_Spec.pdf; ComponentLink1Description: http://media.digikey.com/pdf/Data%20Sheets/AVX%20PDFs/CX3225CA16000H0HSSCC_Spec.pdf; Pricing: 1=1.34, 10=1.19, 50=1.1104, 100=0.9827, 500=0.92868, 750=0.87956, 1000=0.77636 (CAD); Package / Case: 4-SMD, No Lead (DFN, LCC); Mounting Type: Surface Mount; Operating Temperature: -40°C ~ 125°C; RoHS: RoHS Compliant; Supplier Part Number: 1253-1139-1-ND; Supplier: Digi-Key; Size / Dimension: 0.126" L x 0.098" W (3.20mm x 2.50mm); Ratings: AEC-Q200; Packaging: Cut Tape (CT); Height: 0.035" (0.90mm); Type: MHz Crystal; Category: Crystals and Oscillators